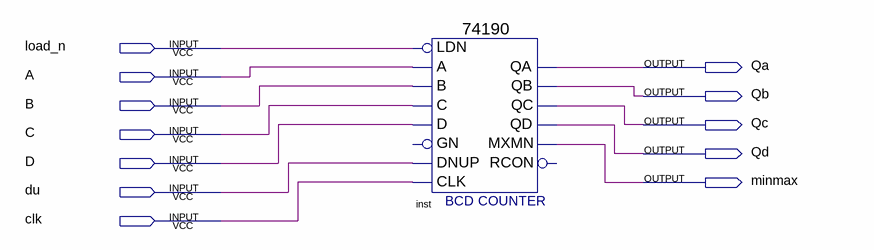
[diagram p0: schematic sheet]
// Quartus schematic test.bdf as structural Verilog: 1 symbols, 12 pins
module test (
  input  load_n,
  input  A,
  input  B,
  input  C,
  input  D,
  input  du,
  input  clk,
  output Qa,
  output Qb,
  output Qc,
  output Qd,
  output minmax
);

  \74190  inst (
    .LDN(load_n), .A(A), .C(C), .B(B), .D(D), .CLK(clk), .DNUP(du), .QA(Qa), .QB(Qb), .QD(Qd), .QC(Qc),
    .MXMN(minmax));  // open: GN, RCON
endmodule
